# Altium project motor.PrjPCB
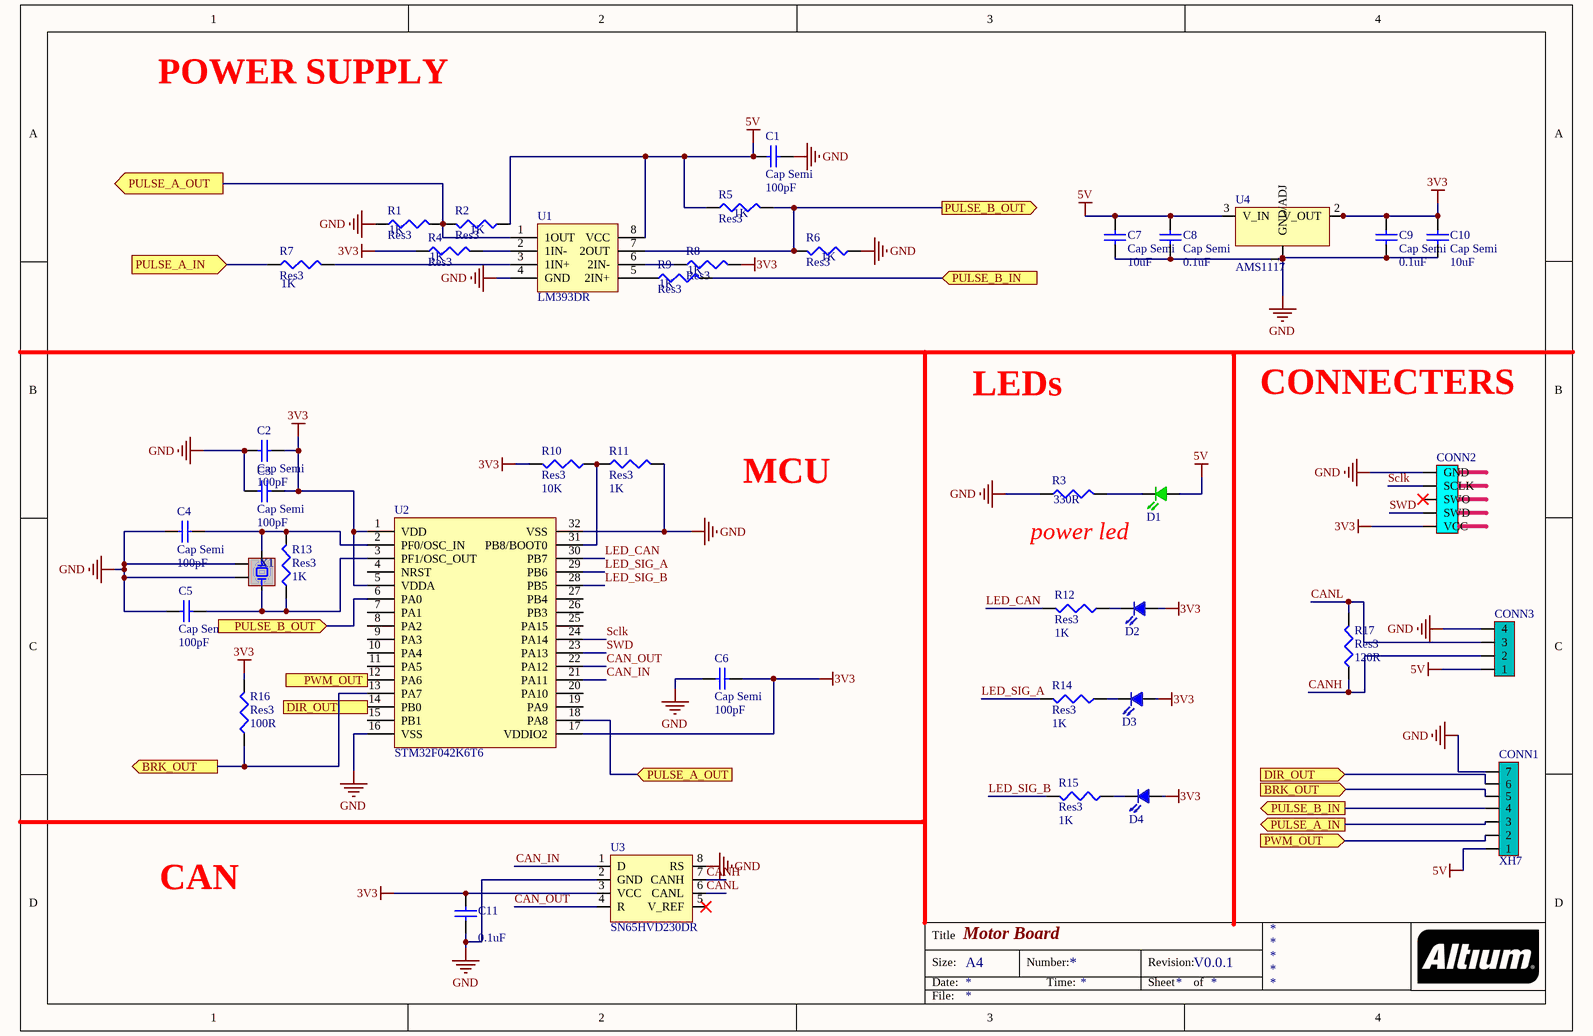
[diagram p0: motor.SchDoc]
1 sheet, 40 parts. Net scope: flat (ports and power ports of the same name join across sheets).
Board file: motor_pcb.PcbDoc

## Sheet motor.SchDoc: Motor Board
size A4; Author: DPL; Revision: V0.0.1

### Parts
C1  Cap Semi  value 100pF  [1608[0603]]
C2  Cap Semi  value 100pF  [1608[0603]]
C3  Cap Semi  value 100pF  [1608[0603]]
C4  Cap Semi  value 100pF  [1608[0603]]
C5  Cap Semi  value 100pF  [1608[0603]]
C6  Cap Semi  value 100pF  [1608[0603]]
C7  Cap Semi  value 10uF  [1608[0603]]
C8  Cap Semi  value 0.1uF  [1608[0603]]
C9  Cap Semi  value 0.1uF  [1608[0603]]
C10  Cap Semi  value 10uF  [1608[0603]]
C11  value 0.1uF  [1608[0603]]  (hidden comment: Cap Semi)
CONN1  XH7  [XH2.54-LI-7P]
CONN2  (no value)  [HDR1X5]
CONN3  (no value)  [XH2.54-LS-4P]
D1  Green  [LED603N]  (value not drawn)
D2  Blue  [LED603N]  (value not drawn)
D3  Blue  [LED603N]  (value not drawn)
D4  Blue  [LED603N]  (value not drawn)
R1  Res3  value 1K  [J1-0603]
R2  Res3  value 1K  [J1-0603]
R3  value 330R  [J1-0603]  (hidden comment: Res3)
R4  Res3  value 1K  [J1-0603]
R5  Res3  value 1K  [J1-0603]
R6  Res3  value 1K  [J1-0603]
R7  Res3  value 1K  [J1-0603]
R8  Res3  value 1K  [J1-0603]
R9  Res3  value 1K  [J1-0603]
R10  Res3  value 10K  [J1-0603]
R11  Res3  value 1K  [J1-0603]
R12  Res3  value 1K  [J1-0603]
R13  Res3  value 1K  [J1-0603]
R14  Res3  value 1K  [J1-0603]
R15  Res3  value 1K  [J1-0603]
R16  Res3  value 100R  [J1-0603]
R17  Res3  value 120R  [J1-0603]
U1  LM393DR  [LM393DR]
U2  STM32F042K6T6  [STM32 32 PIN]
U3  SN65HVD230DR  [SN65HVD230]
U4  AMS1117  [SOT230P700X180-4N]
X1  8MHz  [XTAL ACT530SMX-4 Series]  (value not drawn)

### Ports
BRK_OUT (in), BRK_OUT (out), DIR_OUT (in), DIR_OUT (out), PULSE_A_IN (in), PULSE_A_IN (out), PULSE_A_OUT (in), PULSE_A_OUT (out), PULSE_B_IN (in), PULSE_B_IN (out), PULSE_B_OUT (in), PULSE_B_OUT (out), PWM_OUT (in), PWM_OUT (out)

### Nets
3V3: C2.2 C3.2 C6.1 C9.2 C10.2 C11.2 CONN2.1(VCC) D2.2(A) D3.2(A) D4.2(A) R4.1 R8.2 R10.2 R16.2 U2.1(VDD) U2.5(VDDA) U2.17(VDDIO2) U3.3(VCC) U4.2(V_OUT)
5V: C1.1 C7.2 C8.2 CONN1.1 CONN3.1 D1.2(A) R2.1 R5.1 U1.8(VCC) U4.3(V_IN)
GND: C1.2 C2.1 C3.1 C4.1 C5.1 C6.2 C7.1 C8.1 C9.1 C10.1 C11.1 CONN1.7 CONN2.5(GND) CONN3.4 R1.1 R3.1 R6.1 R11.2 U1.4(GND) U2.16(VSS) U2.32(VSS) U3.2(GND) U3.8(RS) U4.1(GND/ADJ) X1.2 X1.4
CAN_IN: U2.21(PA11) U3.1(D)
CAN_OUT: U2.22(PA12) U3.4(R)
CANH: CONN3.2 R17.1 U3.7(CANH)
CANL: CONN3.3 R17.2 U3.6(CANL)
LED_CAN: R12.2 U2.30(PB7)
LED_SIG_A: R14.2 U2.29(PB6)
LED_SIG_B: R15.2 U2.28(PB5)
Sclk: CONN2.4(SCLK) U2.24(PA14)
SWD: CONN2.2(SWD) U2.23(PA13)
NetC4_2: C4.2 R13.2 U2.2(PF0/OSC_IN) X1.3
NetC5_2: C5.2 R13.1 U2.3(PF1/OSC_OUT) X1.1
NetCONN1_2: CONN1.2 U2.12(PA6) ; port PWM_OUT
NetCONN1_3: CONN1.3 R7.1 ; port PULSE_A_IN
NetCONN1_4: CONN1.4 R9.2 ; port PULSE_B_IN
NetCONN1_5: CONN1.5 R16.1 U2.13(PA7) ; port BRK_OUT
NetCONN1_6: CONN1.6 U2.14(PB0) ; port DIR_OUT
NetD1_1: D1.1(K) R3.2
NetD2_1: D2.1(K) R12.1
NetD3_1: D3.1(K) R14.1
NetD4_1: D4.1(K) R15.1
NetR1_2: R1.2 R2.2 U1.1(1OUT) U2.18(PA8) ; port PULSE_A_OUT
NetR4_2: R4.2 U1.2(1IN-)
NetR5_2: R5.2 R6.2 U1.7(2OUT) U2.6(PA0) ; port PULSE_B_OUT
NetR7_2: R7.2 U1.3(1IN+)
NetR8_1: R8.1 U1.6(2IN-)
NetR9_1: R9.1 U1.5(2IN+)
NetR10_1: R10.1 R11.1 U2.31(PB8/BOOT0)

Not connected (* = marked no-connect by the designer): CONN2 3(SWO)*; U2 4(NRST) 7(PA1) 8(PA2) 9(PA3) 10(PA4) 11(PA5) 15(PB1) 19(PA9) 20(PA10) 25(PA15) 26(PB3) 27(PB4); U3 5(V_REF)*

### Notes on the sheet
- POWER SUPPLY
- LEDs
- CONNECTERS
- MCU
- power led
- CAN
- Title
- Size:
- Date:
- A4
- Number:
- Time:
- Revision:
- Sheet
- of
- File:

### Library data of the parts
C1-C11 = Cap Semi: Capacitor (Semiconductor SIM Model); Published: 8-Jun-2000; LatestRevisionDate: 29-May-2009; LatestRevisionNote: IPC-7351 Footprint Added.; PackageReference: C1206; Publisher: Altium Limited; PackageDescription: Chip Capacitor
CONN1 = XH7: JST-SH 5-pin Side Entry Socket; Manufacturer: Generic Components; Class: Connector; Supplier 1: Digi-Key; Supplier Part Number 1: 455-1804-1-ND
CONN2 = Hdr 5 Pin 0.1
CONN3 = JST-4: JST-SH 4-pin Side Entry Socket; Manufacturer: Generic Components; Class: Connector; Supplier 1: Digi-Key; Supplier Part Number 1: 455-1804-1-ND
D1 = LED 603 Gr: Green 603 LED; Value: 2.1v 20mA; Supplier 1: Digi-Key; Supplier Part Number 1: 754-1116-1-ND
D2-D4 = LED 603 Bl: Blue 603 LED; Supplier 1: Digi-Key; Supplier Part Number 1: 350-2037-1-ND
R1-R17 = Res3: Resistor; Published: 8-Jun-2000; LatestRevisionDate: 29-May-2009; LatestRevisionNote: IPC-7351 Footprint Added.; PackageReference: J1-0603; Publisher: Altium Limited; PackageDescription: Chip Resistor
X1 = XTAL ACT530SMX-4: Surface Mount Quartz Crystal, Digikey 535-9720-1-ND; Class: Oscillator; SubClass: Crystal Oscillator; Supplier 1: Digi-Key; Supplier Part Number 1: 535-9720-1-ND